# Altium project VDMEDA_DisplaySlave.PrjPCB
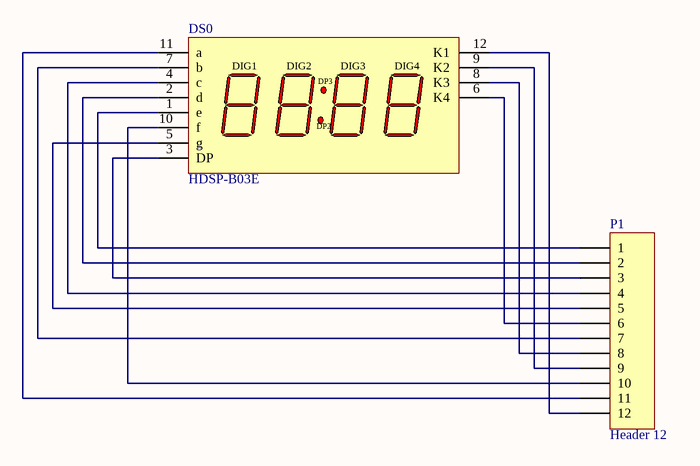
[diagram p0: VDMEDA_DisplaySlave.SchDoc]
1 sheet, 2 parts. Net scope: global (net labels, ports and power ports of the same name join across sheets).
Board file: VDMEDA_DisplaySlave.PcbDoc

## Sheet VDMEDA_DisplaySlave.SchDoc
size A4

### Parts
DS0  HDSP-B03E  [B-88]
P1  Header 12  [HDR1X12]

### Nets
NetDS0_1: DS0.1(e) P1.1
NetDS0_2: DS0.2(d) P1.2
NetDS0_3: DS0.3(DP) P1.3
NetDS0_4: DS0.4(c) P1.4
NetDS0_5: DS0.5(g) P1.5
NetDS0_6: DS0.6(K4) P1.6
NetDS0_7: DS0.7(b) P1.7
NetDS0_8: DS0.8(K3) P1.8
NetDS0_9: DS0.9(K2) P1.9
NetDS0_10: DS0.10(f) P1.10
NetDS0_11: DS0.11(a) P1.11
NetDS0_12: DS0.12(K1) P1.12

### Notes on the sheet
- (in symbol HDSP-B03E) DIG1; DIG2; DIG3; DIG4; DP3; DP2

### Library data of the parts
DS0 = HDSP-B03E: 14.22 mm GaP HER, Untinted, 88:88 4-Digit 7-Segment Display: CC, Gray Surface; LuminousIntensity: 3200 ucd (Minimum).; LED_Colour: High Efficiency Red (HER); Published: 26-May-2004; LatestRevisionDate: 11-Oct-2004; LatestRevisionNote: Display outline superimposed on PCB Footprint.; DatasheetVersion: 21-Aug-2001; PackageVersion: 21-Aug-2001; PackageReference: B-88; Publisher: Altium Limited; PackageDescription: LED, 7-Segment Display, 14.22 mm, Four Digit, 88:88; 12 Leads; Row Space 15.24 mm; Pitch 2.54 mm; ComponentLink1Description: Manufacturer Link; ComponentLink1URL: http://www.agilent.com/; ComponentLink2Description: Datasheet; ComponentLink2URL: http://cp.literature.agilent.com/litweb/pdf/5988-3569EN.pdf
P1 = Header 12: Header, 12-Pin; LatestRevisionDate: 17-Jul-2002; LatestRevisionNote: Re-released for DXP Platform.; Publisher: Altium Limited